# Altium schematic sheet Camera.SchDoc
size A
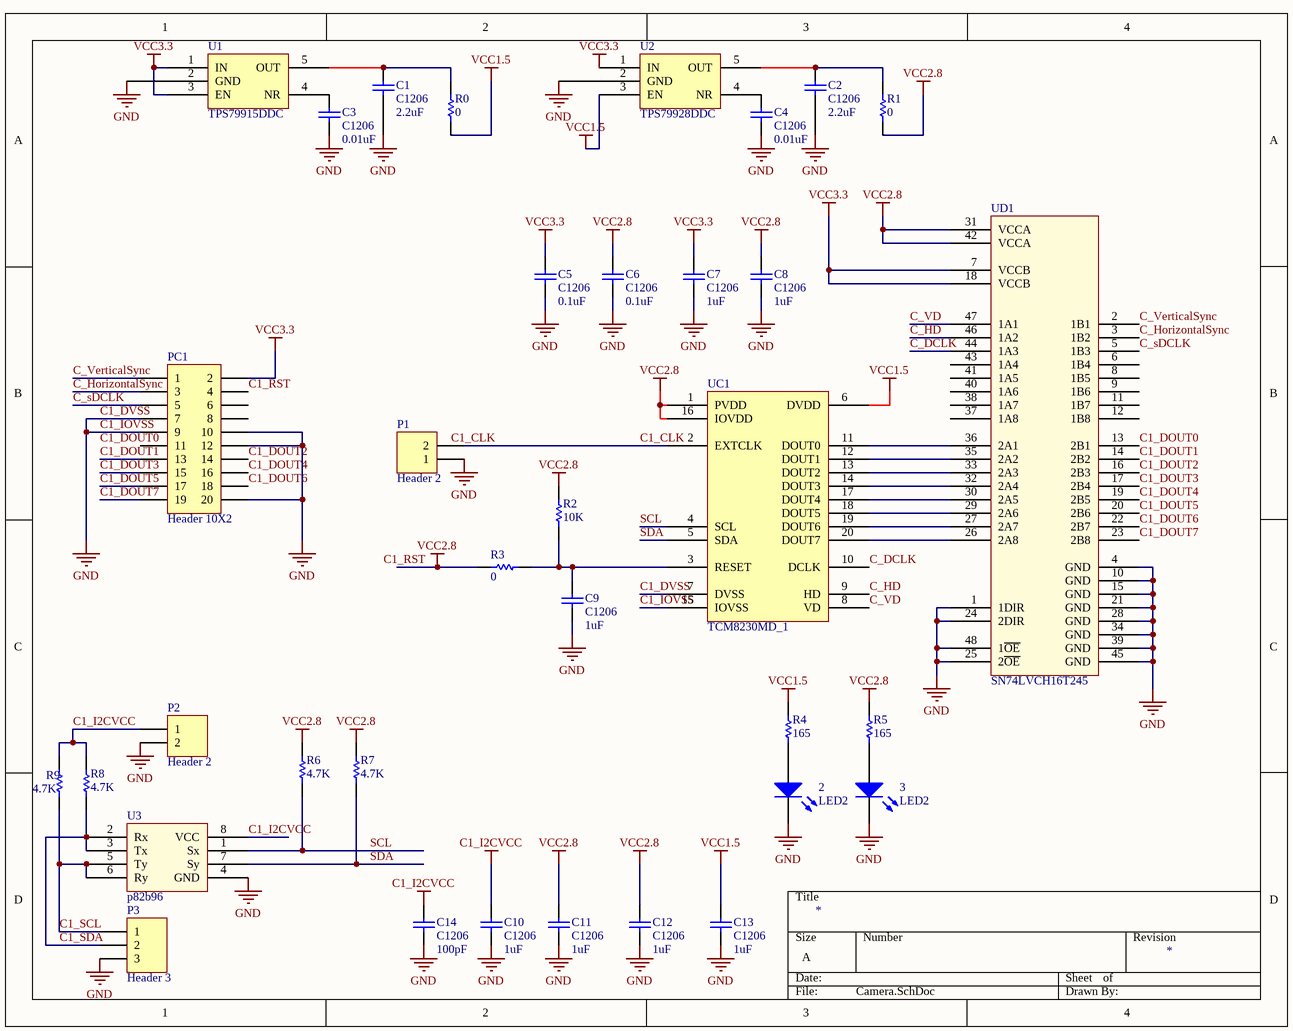
[diagram p0: Camera.SchDoc]

## Parts
2  LED2  [DIODE1608]
3  LED2  [DIODE1608]
C1  C1206  value 2.2uF  [1206]
C2  C1206  value 2.2uF  [1206]
C3  C1206  value 0.01uF  [1206]
C4  C1206  value 0.01uF  [1206]
C5  C1206  value 0.1uF  [1206]
C6  C1206  value 0.1uF  [1206]
C7  C1206  value 1uF  [1206]
C8  C1206  value 1uF  [1206]
C9  C1206  value 1uF  [1206]
C10  C1206  value 1uF  [1206]
C11  C1206  value 1uF  [1206]
C12  C1206  value 1uF  [1206]
C13  C1206  value 1uF  [1206]
C14  C1206  value 100pF  [1206]
P1  Header 2  [HDR1X2]
P2  Header 2  [HDR1X2]
P3  Header 3  [HDR1X3]
PC1  Header 10X2  [HDR2X10]
R0  0  [8-1206]
R1  0  [8-1206]
R2  10K  [8-1206]
R3  0  [8-1206]
R4  165  [8-1206]
R5  165  [8-1206]
R6  4.7K  [8-1206]
R7  4.7K  [8-1206]
R8  4.7K  [8-1206]
R9  4.7K  [8-1206]
U1  TPS79915DDC  [TSOT23-5]
U2  TPS79928DDC  [TSOT23-5]
U3  p82b96  [DIP-8]
UC1  TCM8230MD_1  [TCM8230MD]
UD1  SN74LVCH16T245  [SN74LVCH16T245]

## Nets
C1_DVSS: 2.2(K) 3.2(K) C1.1 C2.1 C3.1 C4.1 C5.1 C6.1 C7.1 C8.1 C9.1 C10.1 C11.1 C12.1 C13.1 C14.1 P1.1 P2.2 P3.3 PC1.7 PC1.9 PC1.10 PC1.12 PC1.20 U1.2(GND) U2.2(GND) U3.4(GND) UC1.7(DVSS) UC1.15(IOVSS) UD1.1(1DIR) UD1.4(GND) UD1.10(GND) UD1.15(GND) UD1.21(GND) UD1.24(2DIR) UD1.25(2~{OE}) UD1.28(GND) UD1.34(GND) UD1.39(GND) UD1.45(GND) UD1.48(1~{OE})  [also labelled C1_IOVSS, GND]
C1_I2CVCC: C10.2 C14.2 P2.1 R8.2 R9.2 U3.8(VCC)
VCC1.5: C13.2 R0.1 R4.2 U2.3(EN) UC1.6(DVDD)
VCC2.8: C6.2 C8.2 C11.2 C12.2 R1.1 R2.2 R3.1 R5.2 R6.2 R7.2 UC1.1(PVDD) UC1.16(IOVDD) UD1.31(VCCA) UD1.42(VCCA)
VCC3.3: C5.2 C7.2 PC1.2 U1.1(IN) U1.3(EN) U2.1(IN) UD1.7(VCCB) UD1.18(VCCB)
C1_CLK: P1.2 UC1.2(EXTCLK)
C1_DOUT0: UD1.13(2B1)
C1_DOUT1: PC1.13 UD1.14(2B2)
C1_DOUT2: PC1.14 UD1.16(2B3)
C1_DOUT3: PC1.15 UD1.17(2B4)
C1_DOUT4: PC1.16 UD1.19(2B5)
C1_DOUT5: PC1.17 UD1.20(2B6)
C1_DOUT6: PC1.18 UD1.22(2B7)
C1_DOUT7: PC1.19 UD1.23(2B8)
C1_RST: PC1.4
C1_SCL: P3.1 R9.1 U3.5(Ty) U3.6(Ry)
C1_SDA: P3.2 R8.1 U3.2(Rx) U3.3(Tx)
C_DCLK: UC1.10(DCLK) UD1.44(1A3)
C_HD: UC1.9(HD) UD1.46(1A2)
C_HorizontalSync: PC1.3 UD1.3(1B2)
C_sDCLK: PC1.5 UD1.5(1B3)
C_VD: UC1.8(VD) UD1.47(1A1)
C_VerticalSync: PC1.1 UD1.2(1B1)
SCL: R6.1 U3.1(Sx) UC1.4(SCL)
SDA: R7.1 U3.7(Sy) UC1.5(SDA)
Net2_1: 2.1(A) R4.1
Net3_1: 3.1(A) R5.1
NetC1_2: C1.2 R0.2 U1.5(OUT)
NetC2_2: C2.2 R1.2 U2.5(OUT)
NetC3_2: C3.2 U1.4(NR)
NetC4_2: C4.2 U2.4(NR)
NetC9_2: C9.2 R2.1 R3.2 UC1.3(RESET)
NetUC1_11: UC1.11(DOUT0) UD1.36(2A1)
NetUC1_12: UC1.12(DOUT1) UD1.35(2A2)
NetUC1_13: UC1.13(DOUT2) UD1.33(2A3)
NetUC1_14: UC1.14(DOUT3) UD1.32(2A4)
NetUC1_17: UC1.17(DOUT4) UD1.30(2A5)
NetUC1_18: UC1.18(DOUT5) UD1.29(2A6)
NetUC1_19: UC1.19(DOUT6) UD1.27(2A7)
NetUC1_20: UC1.20(DOUT7) UD1.26(2A8)

Not connected (* = marked no-connect by the designer): PC1 6 8 11; UD1 6(1B4) 8(1B5) 9(1B6) 11(1B7) 12(1B8) 37(1A8) 38(1A7) 40(1A6) 41(1A5) 43(1A4)

## Notes on the sheet
- Labels drawn without touching a wire or pin: C1_CLK, C1_DOUT0, C1_RST

## Library data of the parts
2 3 = LED2: Typical RED, GREEN, YELLOW, AMBER GaAs LED; Published: 8-Jun-2000; LatestRevisionDate: 17-Jul-2002; LatestRevisionNote: Re-released for DXP Platform.; PackageVersion: Feb-2002; PackageReference: 3.2X1.6X1.1; Publisher: Altium Limited; Color: Blue
C1-C14 = C1206: Ceramic Chip Capacitor - Standard; Published: 17-Jul-2002; LatestRevisionDate: 19-Mar-2004; LatestRevisionNote: Silkscreen size reduced.; DatasheetDocument: Mar-2001; PackageDocument: Mar-2001; PackageReference: 1206; Publisher: Altium Limited; Code_JEITA: 1206; Code_IPC: 3216 [1206]; ComponentLink1Description: Manufacturer Link; ComponentLink1URL: http://www.kemet.com/; ComponentLink2Description: Datasheet; ComponentLink2URL: http://www.kemet.com/kemet/web/homepage/kechome.nsf/vapubfilesname/F3102TA.pdf/$file/F3102TA.pdf
P1 P2 = Header 2: Header, 2-Pin; LatestRevisionDate: 17-Jul-2002; LatestRevisionNote: Re-released for DXP Platform.; Publisher: Altium Limited
P3 = Header 3: Header, 3-Pin; LatestRevisionDate: 17-Jul-2002; LatestRevisionNote: Re-released for DXP Platform.; Publisher: Altium Limited
PC1 = Header 10X2: Header, 10-Pin, Dual row; LatestRevisionDate: 17-Jul-2002; LatestRevisionNote: Re-released for DXP Platform.; Publisher: Altium Limited
R0-R9 = ERJ8GE: Thick Film Chip Resistor, 1 Ohm to 10M Ohm Range, 5% Tolerance, 1206 Size, 0.25 W; Note: If flow soldering, adjust pad width of PCB Footprint to 0.7 - 0.8 times the width of the resistor.; Published: 17-Dec-2003; LatestRevisionDate: 19-Mar-2004; LatestRevisionNote: Silkscreen size reduced.; PackageDocument: Mar-2003; PackageReference: 8-1206; Publisher: Altium Limited; Code_IPC: 3216 [1206]; ComponentLink1Description: Manufacturer Link; ComponentLink1URL: http://www.panasonic.com/industrial/components/resistive_products.htm; ComponentLink2Description: Datasheet; ComponentLink2URL: http://www.panasonic.com/industrial/components/pdf/AOA0000CE1.pdf
U1 U2 = TPS799xxDDC: 200mA, Low Quiescent Current, Ultra-Low Noise, High PSRR  Low Dropout Linear Regulator
UC1 = TCM8230MD_1: VGA CAMERA MODULE 640x480
UD1 = SN74LVCH16T245: 16-bit bus transceiver with voltage regulation.